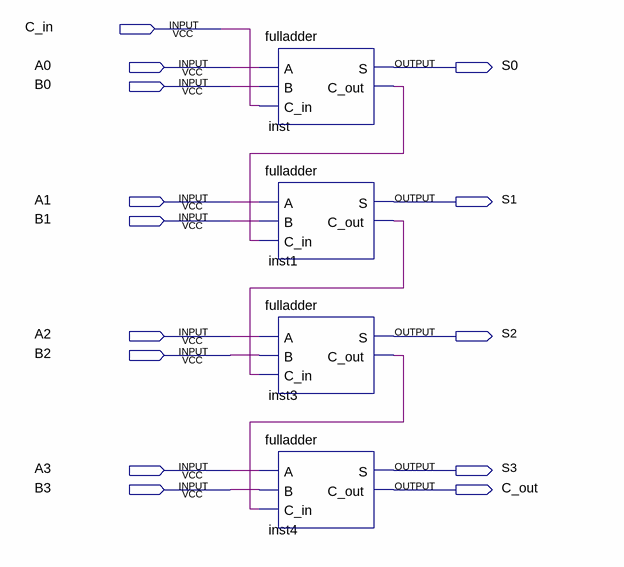
[diagram p0: schematic sheet]
// Quartus schematic somadorquatrobits.bdf as structural Verilog: 4 symbols, 14 pins
module somadorquatrobits (
  input  C_in,
  input  A0,
  input  B0,
  input  A1,
  input  B1,
  input  A2,
  input  B2,
  input  A3,
  input  B3,
  output S0,
  output S1,
  output S2,
  output S3,
  output C_out
);

  wire inst1_c_out, inst3_c_out, inst_c_out;

  fulladder inst (.A(A0), .B(B0), .C_in(C_in), .S(S0), .C_out(inst_c_out));
  fulladder inst1 (.A(A1), .B(B1), .C_in(inst_c_out), .S(S1), .C_out(inst1_c_out));
  fulladder inst3 (.A(A2), .B(B2), .C_in(inst1_c_out), .S(S2), .C_out(inst3_c_out));
  fulladder inst4 (.A(A3), .B(B3), .C_in(inst3_c_out), .S(S3), .C_out(C_out));
endmodule
